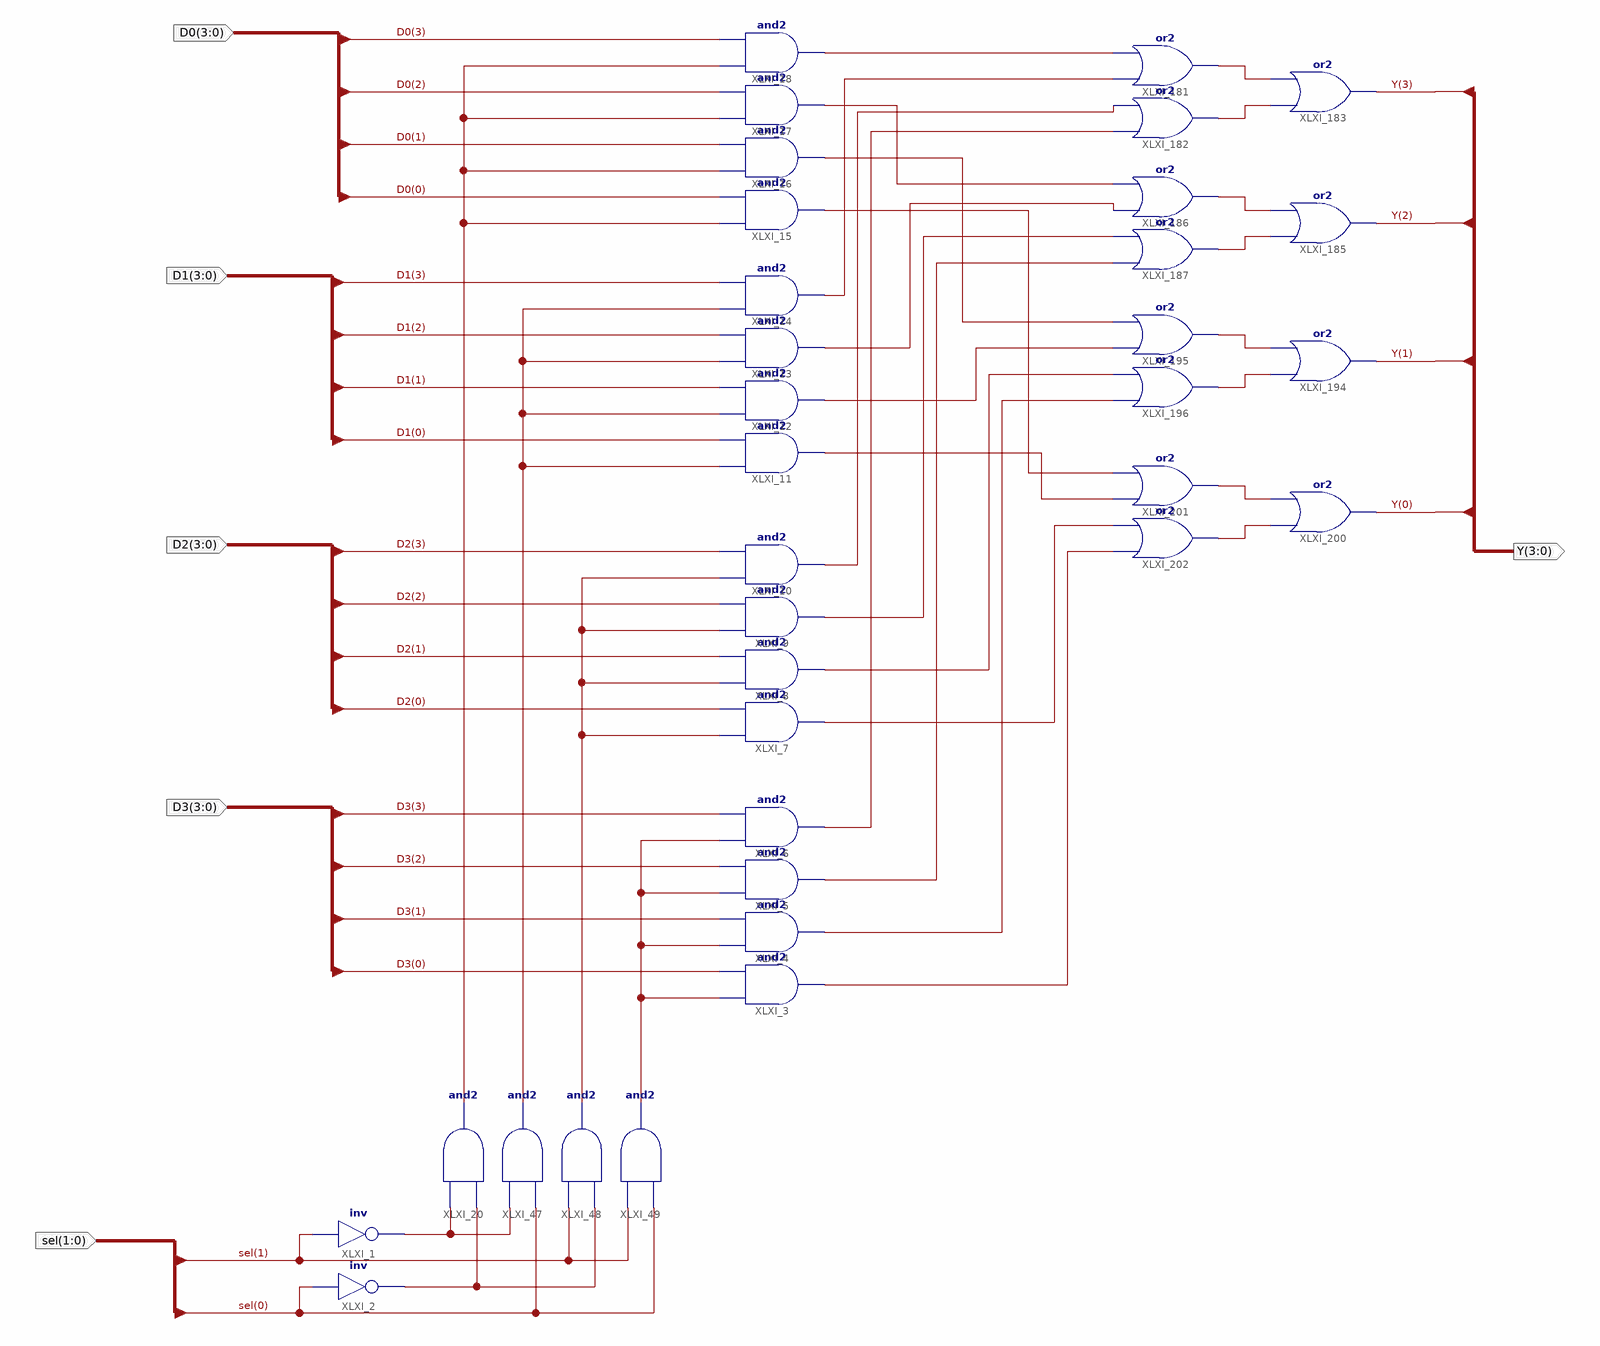
[diagram p0: schematic sheet 1]
// Xilinx ISE schematic Mux4_1_4nn.sch (spartan6) as structural Verilog: 34 symbols, 6 ports
module Mux4_1_4nn (
  input  [3:0] D0,
  input  [3:0] D1,
  input  [3:0] D2,
  input  [3:0] D3,
  input  [1:0] sel,
  output [3:0] Y
);

  wire XLXN_3, XLXN_4, XLXN_74, XLXN_76, XLXN_77, XLXN_78, XLXN_136, XLXN_137, XLXN_139, XLXN_141, XLXN_142,
       XLXN_143, XLXN_144, XLXN_145, XLXN_151, XLXN_154, XLXN_155, XLXN_157, XLXN_158, XLXN_159, XLXN_162,
       XLXN_163, XLXN_164, XLXN_165, XLXN_166, XLXN_167, XLXN_168, XLXN_169, XLXN_170, XLXN_171;

  not XLXI_1 (XLXN_3, sel[1]);
  not XLXI_2 (XLXN_4, sel[0]);
  and XLXI_3 (XLXN_171, XLXN_78, D3[0]);
  and XLXI_4 (XLXN_165, XLXN_78, D3[1]);
  and XLXI_5 (XLXN_157, XLXN_78, D3[2]);
  and XLXI_6 (XLXN_141, XLXN_78, D3[3]);
  and XLXI_7 (XLXN_170, XLXN_77, D2[0]);
  and XLXI_8 (XLXN_164, XLXN_77, D2[1]);
  and XLXI_9 (XLXN_155, XLXN_77, D2[2]);
  and XLXI_10 (XLXN_139, XLXN_77, D2[3]);
  and XLXI_11 (XLXN_169, XLXN_76, D1[0]);
  and XLXI_12 (XLXN_163, XLXN_76, D1[1]);
  and XLXI_13 (XLXN_154, XLXN_76, D1[2]);
  and XLXI_14 (XLXN_137, XLXN_76, D1[3]);
  and XLXI_15 (XLXN_168, XLXN_74, D0[0]);
  and XLXI_16 (XLXN_162, XLXN_74, D0[1]);
  and XLXI_17 (XLXN_151, XLXN_74, D0[2]);
  and XLXI_18 (XLXN_136, XLXN_74, D0[3]);
  and XLXI_47 (XLXN_76, sel[0], XLXN_3);
  and XLXI_20 (XLXN_74, XLXN_4, XLXN_3);
  and XLXI_49 (XLXN_78, sel[0], sel[1]);
  and XLXI_48 (XLXN_77, XLXN_4, sel[1]);
  or XLXI_181 (XLXN_142, XLXN_137, XLXN_136);
  or XLXI_182 (XLXN_143, XLXN_141, XLXN_139);
  or XLXI_183 (Y[3], XLXN_143, XLXN_142);
  or XLXI_185 (Y[2], XLXN_145, XLXN_144);
  or XLXI_186 (XLXN_144, XLXN_154, XLXN_151);
  or XLXI_187 (XLXN_145, XLXN_157, XLXN_155);
  or XLXI_194 (Y[1], XLXN_159, XLXN_158);
  or XLXI_195 (XLXN_158, XLXN_163, XLXN_162);
  or XLXI_196 (XLXN_159, XLXN_165, XLXN_164);
  or XLXI_200 (Y[0], XLXN_167, XLXN_166);
  or XLXI_201 (XLXN_166, XLXN_169, XLXN_168);
  or XLXI_202 (XLXN_167, XLXN_171, XLXN_170);
endmodule
